# EAGLE design LAm (EAGLE 7.7.0)
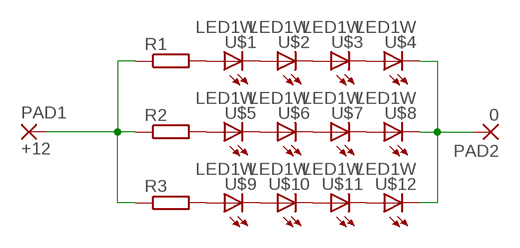
[diagram p0: schematic, sheet 1]

## Parts
PAD1  +12  SMD5  [SMD2,54-5,08]
PAD2  0  SMD5  [SMD2,54-5,08]
R1  R-EU_R0805  [R0805]
R2  R-EU_R0805  [R0805]
R3  R-EU_R0805  [R0805]
U$1  LED1W  [LED-1W]
U$2  LED1W  [LED-1W]
U$3  LED1W  [LED-1W]
U$4  LED1W  [LED-1W]
U$5  LED1W  [LED-1W]
U$6  LED1W  [LED-1W]
U$7  LED1W  [LED-1W]
U$8  LED1W  [LED-1W]
U$9  LED1W  [LED-1W]
U$10  LED1W  [LED-1W]
U$11  LED1W  [LED-1W]
U$12  LED1W  [LED-1W]

## Nets
N$1: R1.2 U$1.A
N$2: U$1.K(C) U$2.A
N$3: U$2.K(C) U$3.A
N$4: U$3.K(C) U$4.A
N$5: R2.2 U$5.A
N$6: U$5.K(C) U$6.A
N$7: U$6.K(C) U$7.A
N$8: U$7.K(C) U$8.A
N$9: R3.2 U$9.A
N$10: U$9.K(C) U$10.A
N$11: U$10.K(C) U$11.A
N$12: U$11.K(C) U$12.A
N$13: PAD1.1(P) R1.1 R2.1 R3.1
N$14: PAD2.1(P) U$4.K(C) U$8.K(C) U$12.K(C)

## Library data of the parts
PAD1 PAD2 = wirepad:SMD5: SMD PAD
R1-R3 = rcl:R-EU_: RESISTOR, European symbol
U$1-U$12 = Namenlos:LED

## Board
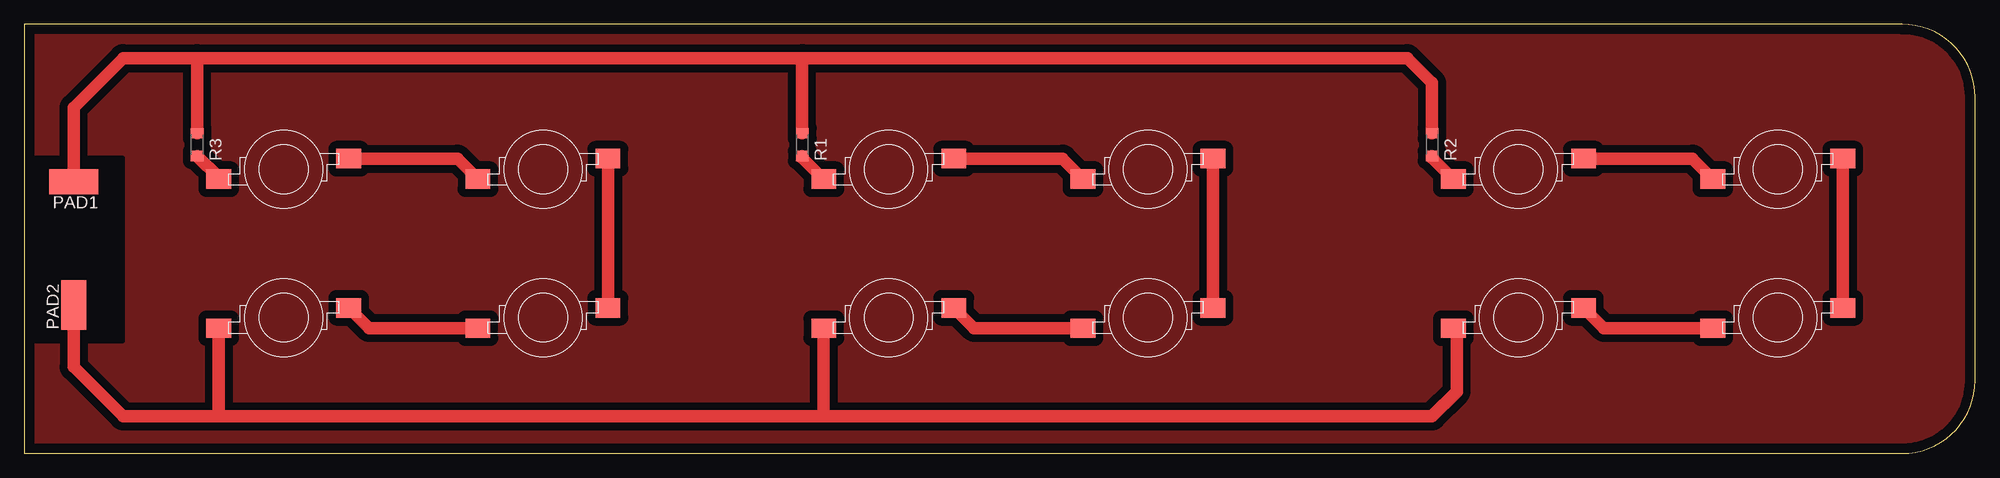
[diagram p1: board, top side]

Size 200.64 x 44.12 mm. Coordinates in mm from the lower left corner, seen from the top.
Outline: 0,0 193.14,0 arc90 200.64,7.5 200.64,36.62 arc90 193.14,44.12 0,44.12 0,0
Copper layers (1*16): Top 0.035mm / dielectric 1.5mm / Bottom 0.035mm
Design rules "default": minimum track width 10mil, minimum drill 24mil, track to track 8mil, track to pad 8mil, pad to pad 8mil, via to via 8mil, smd to smd 8mil, copper to edge 40mil, drill to drill 8mil, minimum pad ring 10mil, minimum via ring 8mil, stop-mask expansion 4mil, vias tented up to drill 0mil, thermal gap 10mil

### Footprints (pad centres in the part's own frame; a part is rotated, then mirrored left to right if it is on the bottom)
SMD2,54-5,08 = smd 2.54 x 5.08: 1 0,0
R0805 = smd 1.05 x 1.3: 1 -1.175,0; 2 1.175,0
LED-1W = smd 2.54 x 2: A -6.685,-1; K 6.685,1.1

### Placement (x,y rotation side)
PAD1  5.08,27.94 90 top
PAD2  5.08,15.24 0 top
R1  80.01,31.75 270 top
R2  144.78,31.75 270 top
R3  17.78,31.75 270 top
U$1  88.9,29.21 0 top
U$2  115.57,29.21 0 top
U$3  115.57,13.97 180 top
U$4  88.9,13.97 180 top
U$5  153.67,29.21 0 top
U$6  180.34,29.21 0 top
U$7  180.34,13.97 180 top
U$8  153.67,13.97 180 top
U$9  26.67,29.21 0 top
U$10  53.34,29.21 0 top
U$11  53.34,13.97 180 top
U$12  26.67,13.97 180 top

### Tracks (layer width: path | path; a pad name or v marks a point on that pad's centre or on a via)
N$1
  Top 1.27: R1.2 80.01,30.41 U$1.A
N$2
  Top 1.27: U$1.K 106.78,30.31 U$2.A
N$3
  Top 1.27: U$2.K U$3.A
N$4
  Top 1.27: U$3.K 97.69,12.87 U$4.A
N$5
  Top 1.27: R2.2 144.78,30.41 U$5.A
N$6
  Top 1.27: U$5.K 171.56,30.31 U$6.A
N$7
  Top 1.27: U$6.K U$7.A
N$8
  Top 1.27: U$7.K 162.46,12.87 U$8.A
N$9
  Top 1.27: U$9.A 19.98,28.37 R3.2
N$10
  Top 1.27: U$9.K 44.55,30.31 U$10.A
N$11
  Top 1.27: U$10.K U$11.A
N$12
  Top 1.27: U$11.K 35.45,12.87 U$12.A
N$13
  Top 1.27: PAD1.1 5.08,35.56 10.16,40.64 17.78,40.64 | 17.78,40.64 80.01,40.64 | 80.01,40.64 142.24,40.64 144.78,38.1 R2.1 | R3.1 17.78,40.64 | R1.1 80.01,40.64
N$14
  Top 1.27: PAD2.1 5.08,8.89 10.16,3.81 20.32,3.81 | 20.32,3.81 82.55,3.81 | 82.55,3.81 144.78,3.81 147.32,6.35 147.32,12.7 147.16,12.7 U$8.K | U$4.K 82.22,4.14 82.55,3.81 | U$12.K 19.98,4.14 20.32,3.81
N$15
  pour Top (isolate 0.813): 0,44.45 193.16,44.45 arc-90 200.66,36.95 200.66,7.5 arc-90 193.16,0 0,0
N$16
  cutout Top (isolate 0.813): 0,30.48 10.16,30.48 10.16,11.43 0,11.43